# Altium schematic sheet NVME.SchDoc
size A3
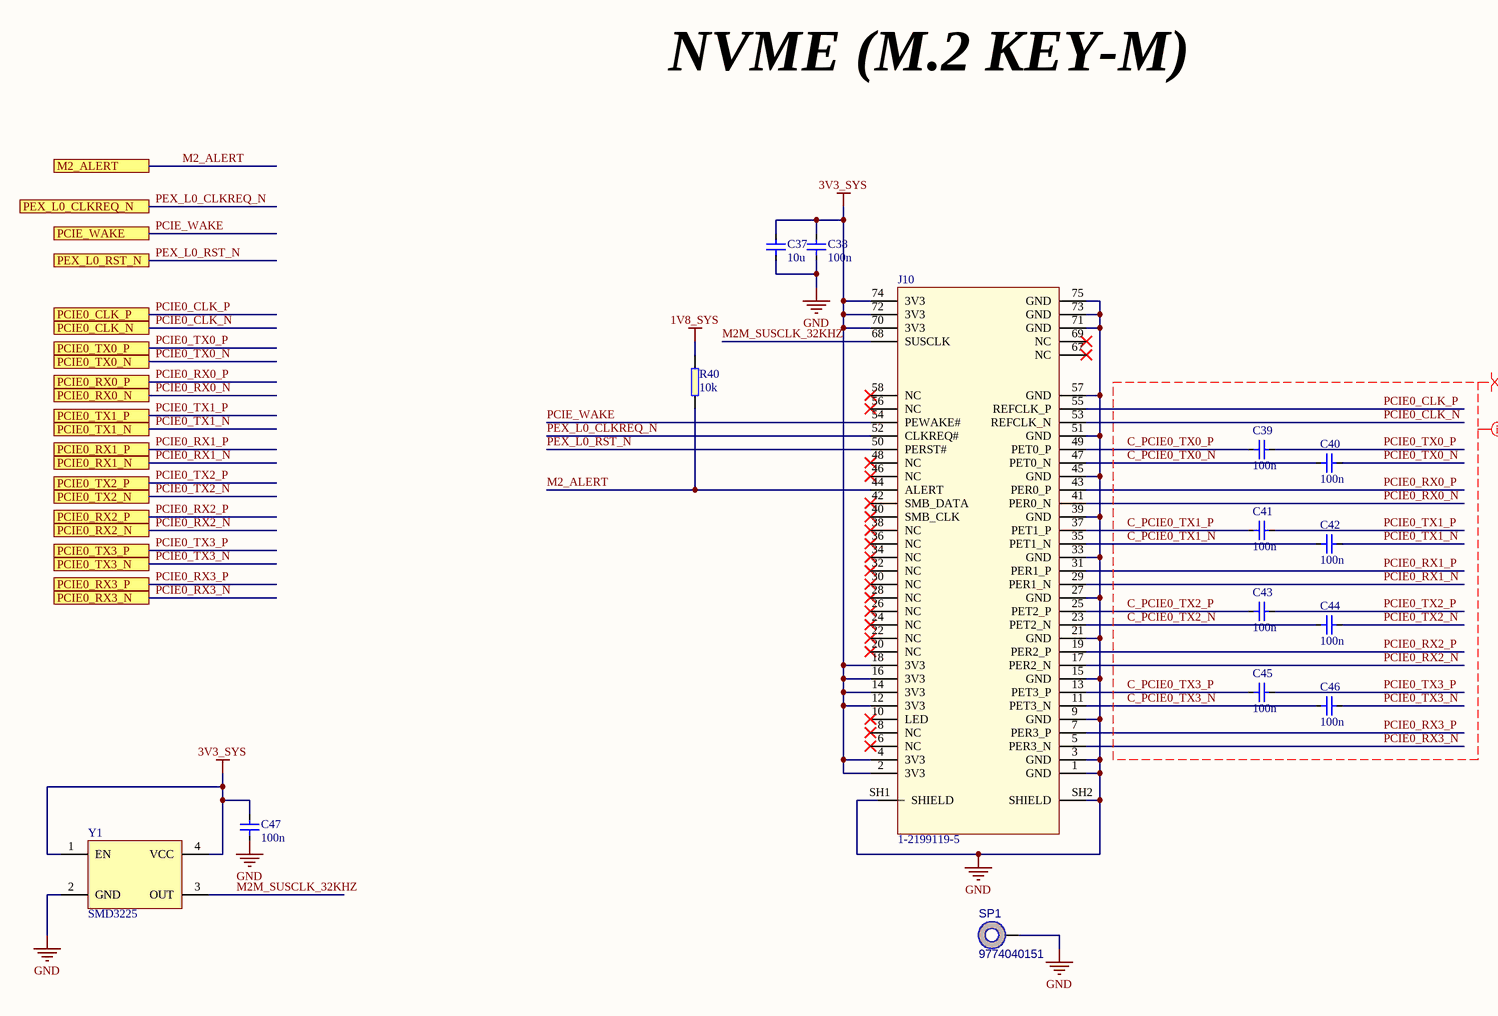
[diagram p0: NVME.SchDoc]

## Parts
C37  10u  [C0402]
C38  100n  [C0402]
C39  100n  [C0402]
C40  100n  [C0402]
C41  100n  [C0402]
C42  100n  [C0402]
C43  100n  [C0402]
C44  100n  [C0402]
C45  100n  [C0402]
C46  100n  [C0402]
C47  100n  [C0402]
J10  1-2199119-5  [1-2199119-5]
R40  10k  [R0402]
SP1  9774040151  [MEC_STANDOFF_PTH_620C380P]
Y1  SMD3225  [XTAL_SMD_4_032X025_D]

## Ports
M2_ALERT, PCIE0_CLK_N, PCIE0_CLK_P, PCIE0_RX0_N, PCIE0_RX0_P, PCIE0_RX1_N, PCIE0_RX1_P, PCIE0_RX2_N, PCIE0_RX2_P, PCIE0_RX3_N, PCIE0_RX3_P, PCIE0_TX0_N, PCIE0_TX0_P, PCIE0_TX1_N, PCIE0_TX1_P, PCIE0_TX2_N, PCIE0_TX2_P, PCIE0_TX3_N, PCIE0_TX3_P, PCIE_WAKE, PEX_L0_CLKREQ_N, PEX_L0_RST_N

## Nets
1V8_SYS: R40.2
3V3_SYS: C37.2 C38.2 C47.2 J10.2(3V3) J10.4(3V3) J10.12(3V3) J10.14(3V3) J10.16(3V3) J10.18(3V3) J10.70(3V3) J10.72(3V3) J10.74(3V3) Y1.1(EN) Y1.4(VCC)
GND: C37.1 C38.1 C47.1 J10.1(GND) J10.3(GND) J10.9(GND) J10.15(GND) J10.21(GND) J10.27(GND) J10.33(GND) J10.39(GND) J10.45(GND) J10.51(GND) J10.57(GND) J10.71(GND) J10.73(GND) J10.75(GND) J10.SH1(SHIELD) J10.SH2(SHIELD) SP1.1 Y1.2(GND)
C_PCIE0_TX0_N: C40.1 J10.47(PET0_N)
C_PCIE0_TX0_P: C39.1 J10.49(PET0_P)
C_PCIE0_TX1_N: C42.1 J10.35(PET1_N)
C_PCIE0_TX1_P: C41.1 J10.37(PET1_P)
C_PCIE0_TX2_N: C44.1 J10.23(PET2_N)
C_PCIE0_TX2_P: C43.1 J10.25(PET2_P)
C_PCIE0_TX3_N: C46.1 J10.11(PET3_N)
C_PCIE0_TX3_P: C45.1 J10.13(PET3_P)
M2_ALERT: J10.44(ALERT) R40.1 ; port M2_ALERT
M2M_SUSCLK_32KHZ: J10.68(SUSCLK) Y1.3(OUT)
PCIE0_CLK_N: J10.53(REFCLK_N) ; port PCIE0_CLK_N
PCIE0_CLK_P: J10.55(REFCLK_P) ; port PCIE0_CLK_P
PCIE0_RX0_N: J10.41(PER0_N) ; port PCIE0_RX0_N
PCIE0_RX0_P: J10.43(PER0_P) ; port PCIE0_RX0_P
PCIE0_RX1_N: J10.29(PER1_N) ; port PCIE0_RX1_N
PCIE0_RX1_P: J10.31(PER1_P) ; port PCIE0_RX1_P
PCIE0_RX2_N: J10.17(PER2_N) ; port PCIE0_RX2_N
PCIE0_RX2_P: J10.19(PER2_P) ; port PCIE0_RX2_P
PCIE0_RX3_N: J10.5(PER3_N) ; port PCIE0_RX3_N
PCIE0_RX3_P: J10.7(PER3_P) ; port PCIE0_RX3_P
PCIE0_TX0_N: C40.2 ; port PCIE0_TX0_N
PCIE0_TX0_P: C39.2 ; port PCIE0_TX0_P
PCIE0_TX1_N: C42.2 ; port PCIE0_TX1_N
PCIE0_TX1_P: C41.2 ; port PCIE0_TX1_P
PCIE0_TX2_N: C44.2 ; port PCIE0_TX2_N
PCIE0_TX2_P: C43.2 ; port PCIE0_TX2_P
PCIE0_TX3_N: C46.2 ; port PCIE0_TX3_N
PCIE0_TX3_P: C45.2 ; port PCIE0_TX3_P
PCIE_WAKE: J10.54(PEWAKE#) ; port PCIE_WAKE
PEX_L0_CLKREQ_N: J10.52(CLKREQ#) ; port PEX_L0_CLKREQ_N
PEX_L0_RST_N: J10.50(PERST#) ; port PEX_L0_RST_N

Not connected (* = marked no-connect by the designer): J10 6(NC)* 8(NC)* 10(LED)* 20(NC)* 22(NC)* 24(NC)* 26(NC)* 28(NC)* 30(NC)* 32(NC)* 34(NC)* 36(NC)* 38(NC)* 40(SMB_CLK)* 42(SMB_DATA)* 46(NC)* 48(NC)* 56(NC)* 58(NC)* 67(NC)* 69(NC)*

## Layout directives
differential pair: C_PCIE0_TX0_N, C_PCIE0_TX0_P, C_PCIE0_TX1_N, C_PCIE0_TX1_P, C_PCIE0_TX2_N, C_PCIE0_TX2_P, C_PCIE0_TX3_N, C_PCIE0_TX3_P, PCIE0_CLK_N, PCIE0_CLK_P, PCIE0_RX0_N, PCIE0_RX0_P, PCIE0_RX1_N, PCIE0_RX1_P, PCIE0_RX2_N, PCIE0_RX2_P, PCIE0_RX3_N, PCIE0_RX3_P, PCIE0_TX0_N, PCIE0_TX0_P, PCIE0_TX1_N, PCIE0_TX1_P, PCIE0_TX2_N, PCIE0_TX2_P, PCIE0_TX3_N, PCIE0_TX3_P
net class Z_85: C_PCIE0_TX0_N, C_PCIE0_TX0_P, C_PCIE0_TX1_N, C_PCIE0_TX1_P, C_PCIE0_TX2_N, C_PCIE0_TX2_P, C_PCIE0_TX3_N, C_PCIE0_TX3_P, PCIE0_CLK_N, PCIE0_CLK_P, PCIE0_RX0_N, PCIE0_RX0_P, PCIE0_RX1_N, PCIE0_RX1_P, PCIE0_RX2_N, PCIE0_RX2_P, PCIE0_RX3_N, PCIE0_RX3_P, PCIE0_TX0_N, PCIE0_TX0_P, PCIE0_TX1_N, PCIE0_TX1_P, PCIE0_TX2_N, PCIE0_TX2_P, PCIE0_TX3_N, PCIE0_TX3_P

## Notes on the sheet
- NVME (M.2 KEY-M)
- Title
- Size:
- Date:
- A3
- Number:
- Time:
- Revision:
- Sheet
- of
- Go360.io

## Library data of the parts
C37 = C_10u_0402: MLCC SMT Capacitor 10uF 0402; Manufacturer: TDK; PartSymbol: C1005X5R0J106M050BC; PartNumber: C_10u_0402; Value: 10u
C38-C47 = C_100n_0402: MLCC SMT Capacitor 100n 0402; Manufacturer: TDK; PartSymbol: C1005X5R0J104K050BA; PartNumber: C_100n_0402; Value: 100n
J10 = 1-2199119-5: CONN FEMALE 67POS 0.020 GOLD; Manufacturer: TE; PartNumber: 1-2199119-5; Value: 1-2199119-5
R40 = R_10k_0402: RES, 10k, 0402; Manufacturer: MULTICOMP; PartSymbol: MCMR04X1002FTL; PartNumber: R_10k_0402; Value: 10k
SP1 = 9774040151: RND STANDOFF M2.5X0.45 STEEL 4MM; Manufacturer: WURTH ELEKTRONIK; PartNumber: 9774040151; Value: 9774040151; PartSymbol: 9774040151